# EasyEDA schematic I-Ching Device overview EasyEDA.json
TITLE: I-Ching device overview; REV: 1.2; Date: 2020-06-27; Sheet: 1/1; Drawn By: ferrie.bank; Company: Oude Snepelaar
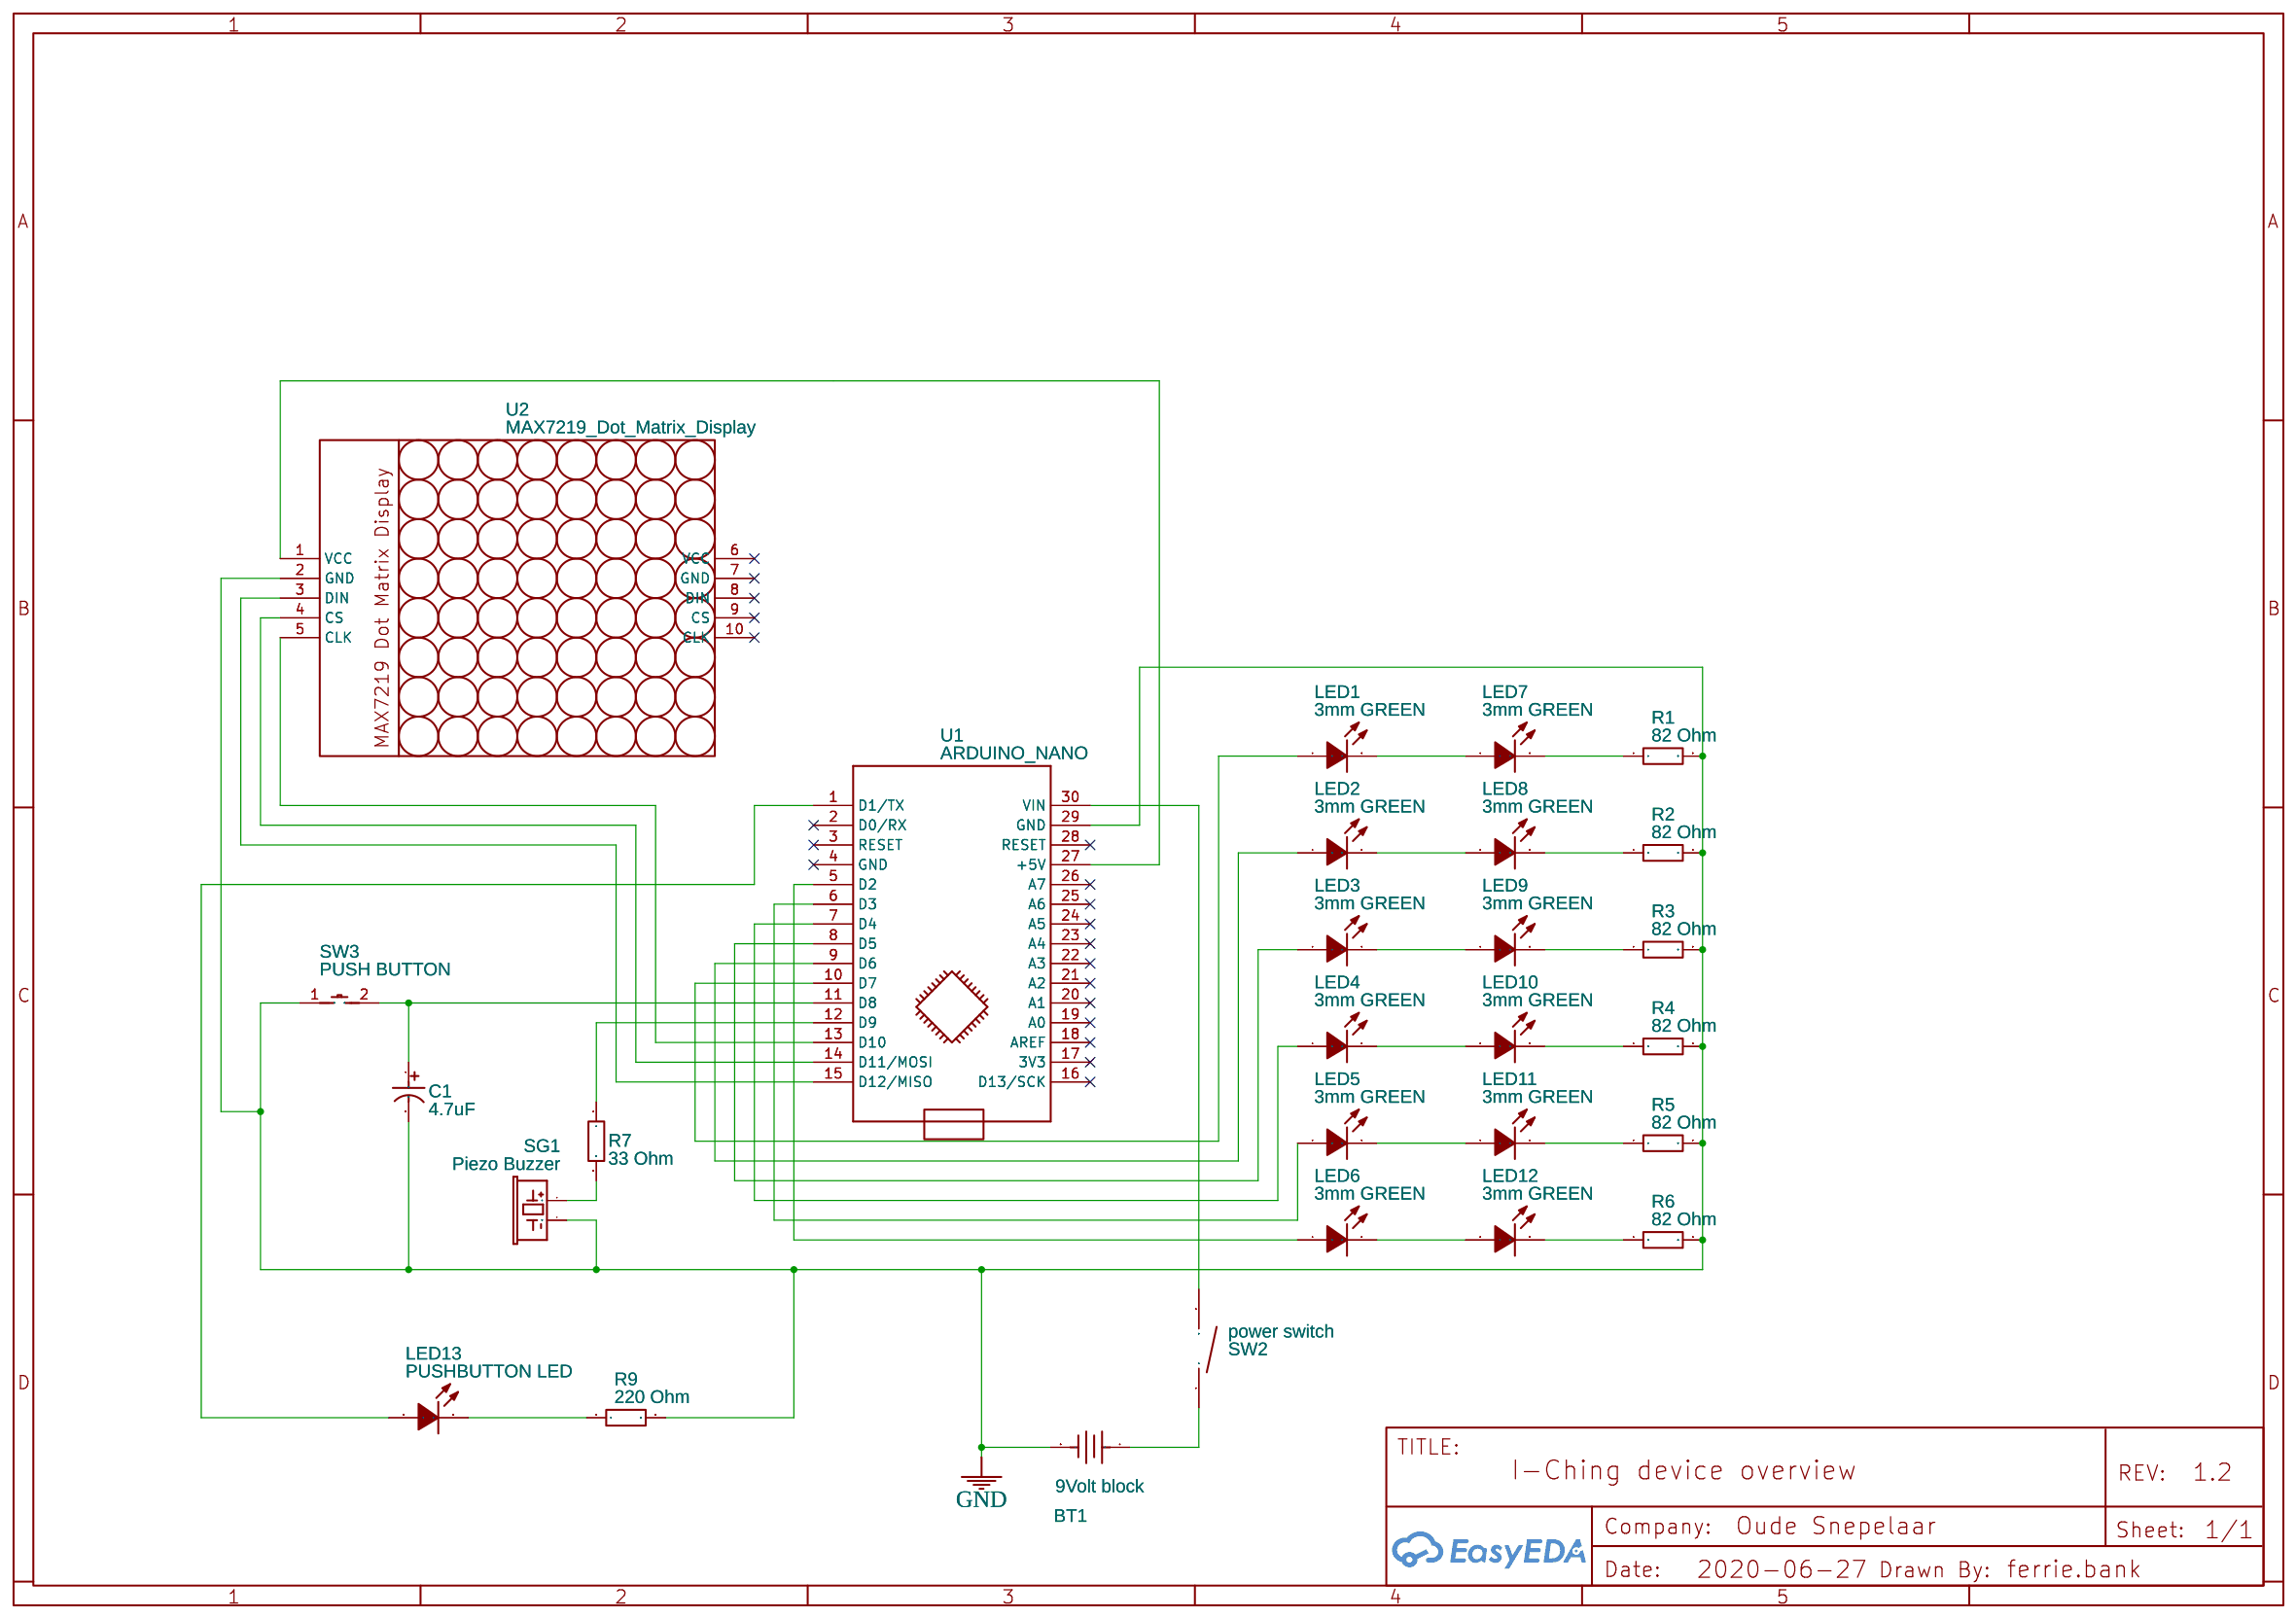
[diagram p0: schematic sheet]

## Parts
BT1  9Volt block  [BAT-TH_1067]
C1  4.7uF  [CAP-TH_BD5.0-P2.00-D0.8-FD]
LED1  3mm GREEN  [LED-TH_BD3.8-P2.54-FD]
LED2  3mm GREEN  [LED-TH_BD3.8-P2.54-FD]
LED3  3mm GREEN  [LED-TH_BD3.8-P2.54-FD]
LED4  3mm GREEN  [LED-TH_BD3.8-P2.54-FD]
LED5  3mm GREEN  [LED-TH_BD3.8-P2.54-FD]
LED6  3mm GREEN  [LED-TH_BD3.8-P2.54-FD]
LED7  3mm GREEN  [LED-TH_BD3.8-P2.54-FD]
LED8  3mm GREEN  [LED-TH_BD3.8-P2.54-FD]
LED9  3mm GREEN  [LED-TH_BD3.8-P2.54-FD]
LED10  3mm GREEN  [LED-TH_BD3.8-P2.54-FD]
LED11  3mm GREEN  [LED-TH_BD3.8-P2.54-FD]
LED12  3mm GREEN  [LED-TH_BD3.8-P2.54-FD]
LED13  PUSHBUTTON LED  [LED-TH_BD3.8-P2.54-FD]
R1  82 Ohm  [RES-TH_BD4.0-L11.5-P15.50-D0.7]
R2  82 Ohm  [RES-TH_BD4.0-L11.5-P15.50-D0.7]
R3  82 Ohm  [RES-TH_BD4.0-L11.5-P15.50-D0.7]
R4  82 Ohm  [RES-TH_BD4.0-L11.5-P15.50-D0.7]
R5  82 Ohm  [RES-TH_BD4.0-L11.5-P15.50-D0.7]
R6  82 Ohm  [RES-TH_BD4.0-L11.5-P15.50-D0.7]
R7  33 Ohm  [RES-TH_BD4.0-L11.5-P15.50-D0.7]
R9  220 Ohm  [RES-TH_BD4.0-L11.5-P15.50-D0.7]
SG1  Piezo Buzzer  [BUZZER-12MM]
SW2  power switch  [SW-TH_P7.00_SS11-RBDWQ-R20-R]
SW3  PUSH BUTTON  [KEY-SMD_L5.3-W5.4-LS5.4]
U1  ARDUINO_NANO  [ARDUINO_NANO]
U2  MAX7219_Dot_Matrix_Display  [MAX7219_LED_MATRIX]

## Library data of the parts
BT1 = 1067: Supplier: LCSC; Supplier Part: C238072; Manufacturer: Keystone; Contributor: LCSC
C1 = 0.1UF 50V: Supplier: LCSC; Manufacturer: ValuePro; Supplier Part: C28061
LED1-LED13 = 3ARG4HWC: Supplier: LCSC; Manufacturer: KENTO; image: //image.lceda.cn/szlcsc/C55640.jpg; Supplier Part: C55640
R1-R7 R9 = MFR2WSJT-73-220R: Supplier: LCSC; Supplier Part: C176568; Manufacturer: YAGEO; Contributor: LCSC
SG1 = Piezo Buzzer: Contributor: SparkFun; sourceId: 0s1nhpZJj
SW2 = SS11-RBDWQ-R20-R: Supplier: LCSC; Supplier Part: C309068; Manufacturer: Legion; Contributor: LCSC
SW3 = SKTQABE010: Supplier: LCSC; Supplier Part: C470454; Manufacturer: ALPS Electric; Contributor: LCSC
U1 = ARDUINO_NANO: sourceId: KGSeAWhDB
U2 = MAX7219_Dot_Matrix_Display: Contributor: O. Bender

## Nets
GND: BT1.2(-) C1.2 R1.2 R2.2 R3.2 R4.2 R5.2 R6.2 R9.2 SG1.-(2) SW3.1 U1.29(GND) U2.2(GND)
Net-(BT1-1): BT1.1(+) SW2.1
Net-(C1-1): C1.1 SW3.2 U1.11(D8)
Net-(LED1-1): LED1.1(A) U1.10(D7)
Net-(LED1-2): LED1.2(K) LED7.1(A)
Net-(LED2-1): LED2.1(A) U1.9(D6)
Net-(LED2-2): LED2.2(K) LED8.1(A)
Net-(LED3-1): LED3.1(A) U1.8(D5)
Net-(LED3-2): LED3.2(K) LED9.1(A)
Net-(LED4-1): LED4.1(A) U1.7(D4)
Net-(LED4-2): LED4.2(K) LED10.1(A)
Net-(LED5-1): LED5.1(A) U1.6(D3)
Net-(LED5-2): LED5.2(K) LED11.1(A)
Net-(LED6-1): LED6.1(A) U1.5(D2)
Net-(LED6-2): LED6.2(K) LED12.1(A)
Net-(LED7-2): LED7.2(K) R1.1
Net-(LED8-2): LED8.2(K) R2.1
Net-(LED9-2): LED9.2(K) R3.1
Net-(LED10-2): LED10.2(K) R4.1
Net-(LED11-2): LED11.2(K) R5.1
Net-(LED12-2): LED12.2(K) R6.1
Net-(LED13-1): LED13.1(A) U1.1(D1/TX)
Net-(LED13-2): LED13.2(K) R9.1
Net-(R7-1): R7.1 U1.12(D9)
Net-(R7-2): R7.2 SG1.+(1)
Net-(SW2-2): SW2.2 U1.30(VIN)
Net-(U1-13): U1.13(D10) U2.5(CLK)
Net-(U1-14): U1.14(D11/MOSI) U2.4(CS)
Net-(U1-15): U1.15(D12/MISO) U2.3(DIN)
Net-(U1-27): U1.27(+5V) U2.1(VCC)

Not connected (* = marked no-connect by the designer): U1 2(D0/RX)* 3(RESET)* 4(GND)* 16(D13/SCK)* 17(3V3)* 18(AREF)* 19(A0)* 20(A1)* 21(A2)* 22(A3)* 23(A4)* 24(A5)* 25(A6)* 26(A7)* 28(RESET)*; U2 6(VCC)* 7(GND)* 8(DIN)* 9(CS)* 10(CLK)*
